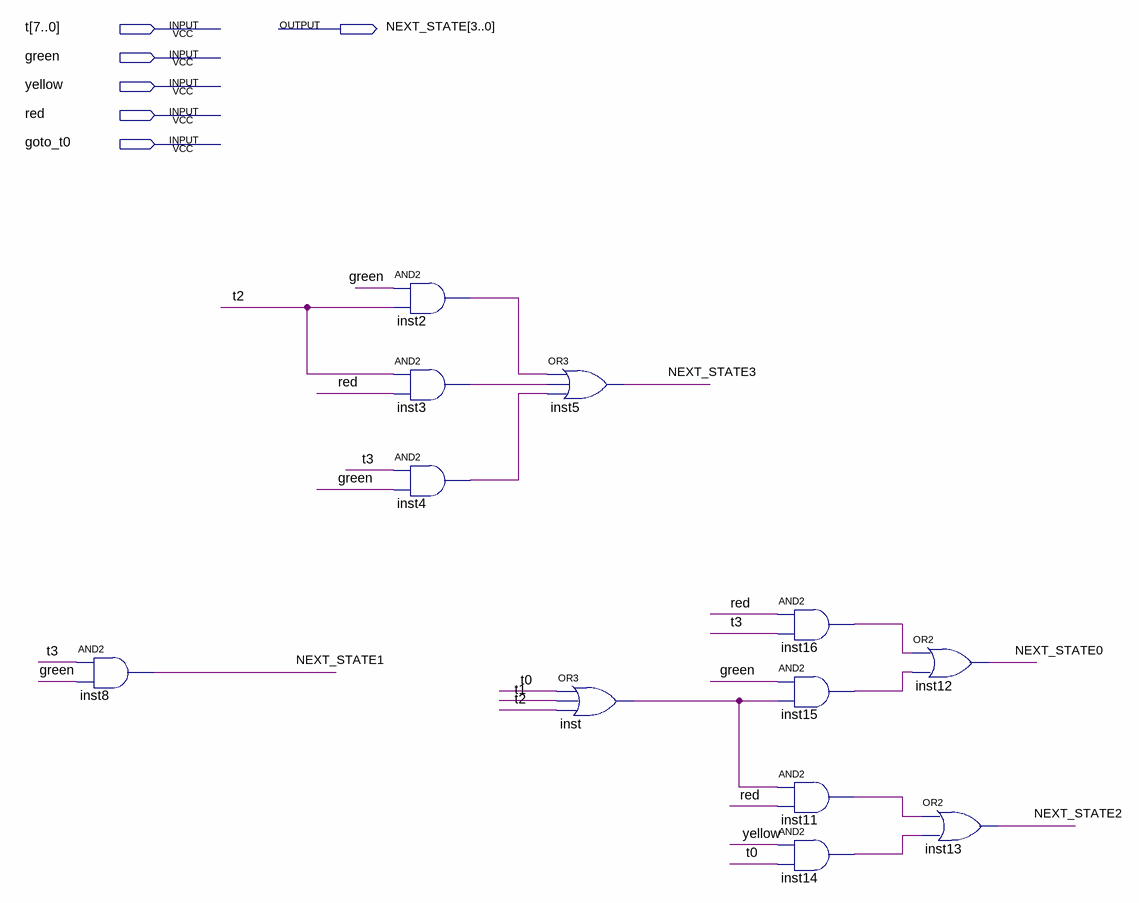
[diagram p0: schematic sheet]
// Quartus schematic fsm_logic.bdf as structural Verilog: 12 symbols, 6 pins
module fsm_logic (
  input  [7:0] t,
  input  green,
  input  yellow,
  input  red,
  input  goto_t0,
  output [3:0] NEXT_STATE
);

  wire inst2_out, inst3_out, inst4_out, inst11_out, inst14_out, inst15_out, inst16_out, inst_out;

  and inst8 (NEXT_STATE[1], t[3], green);
  and inst2 (inst2_out, green, t[2]);
  and inst3 (inst3_out, t[2], red);
  and inst4 (inst4_out, t[3], green);
  or inst5 (NEXT_STATE[3], inst2_out, inst3_out, inst4_out);
  or inst (inst_out, t[0], t[1], t[2]);
  and inst16 (inst16_out, red, t[3]);
  and inst15 (inst15_out, green, inst_out);
  and inst11 (inst11_out, inst_out, red);
  and inst14 (inst14_out, yellow, t[0]);
  or inst12 (NEXT_STATE[0], inst16_out, inst15_out);
  or inst13 (NEXT_STATE[2], inst11_out, inst14_out);
endmodule
